# Altium schematic sheet ballbot_motor_discrete_v22.SchDoc: Ballbot直流电机驱动
size A4; Revision: 2.2; SheetNumber: 1; SheetTotal: 1
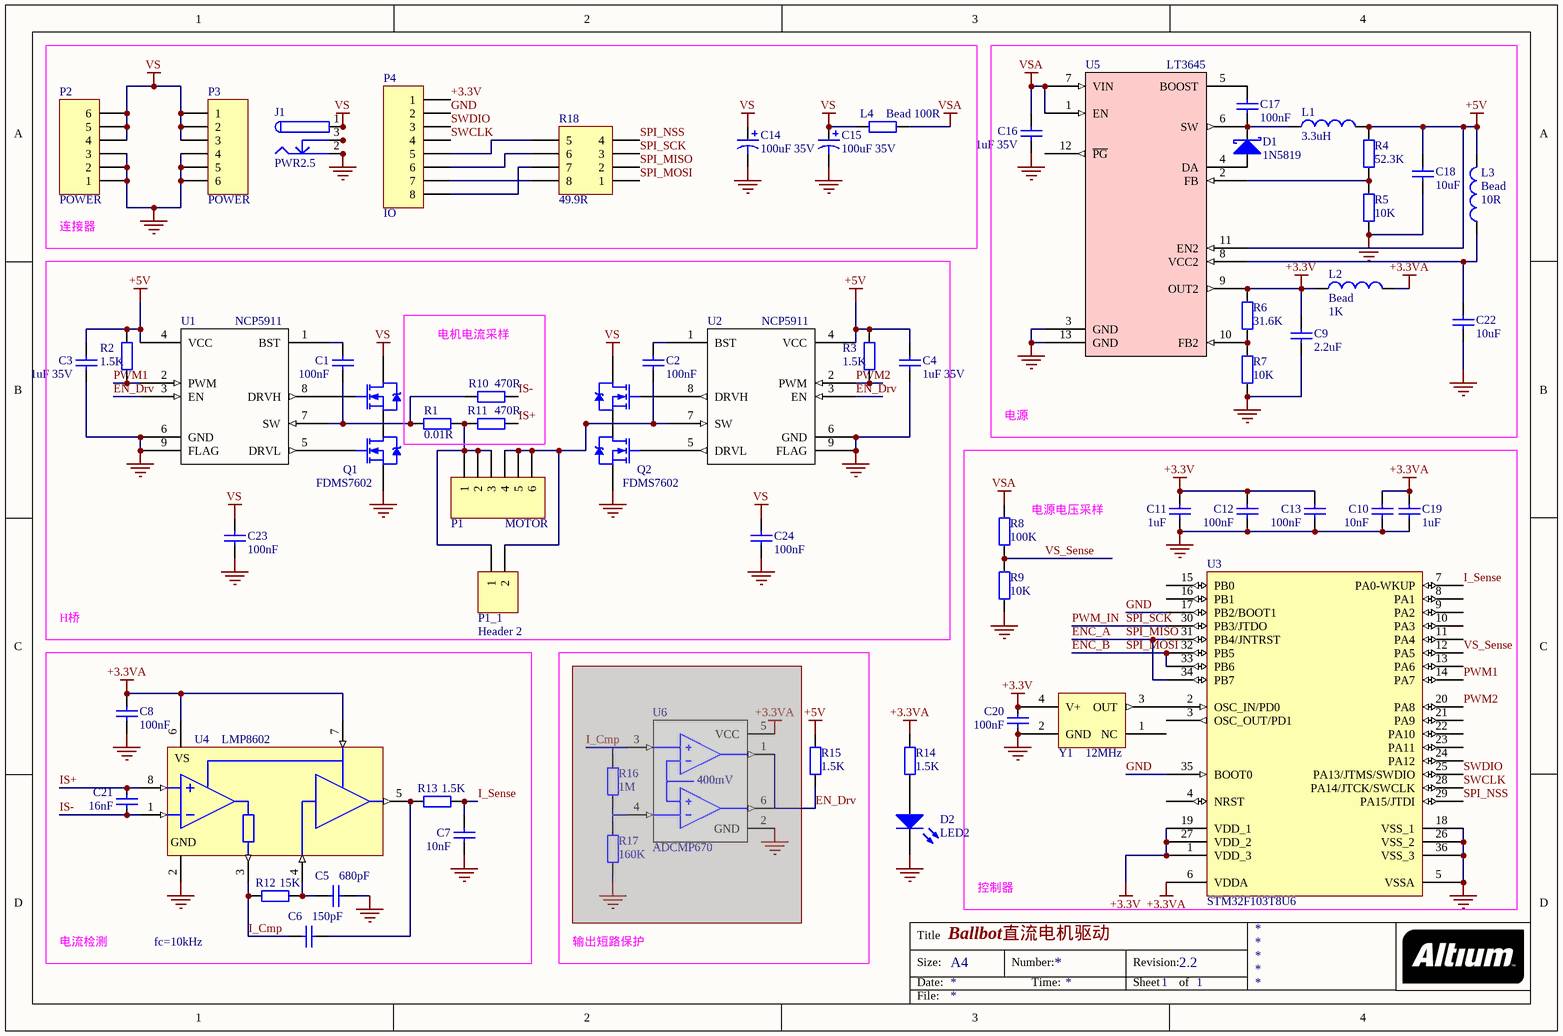
[diagram p0: ballbot_motor_discrete_v22.SchDoc]

## Parts
C1  value 100nF  [CAPC1608N]  (hidden comment: Cap Semi)
C2  value 100nF  [CAPC1608N]  (hidden comment: Cap Semi)
C3  value 1uF 35V  [CAPC1608N]  (hidden comment: Cap Semi)
C4  value 1uF 35V  [CAPC1608N]  (hidden comment: Cap Semi)
C5  value 680pF  [CAPC1608N]  (hidden comment: Cap Semi)
C6  value 150pF  [CAPC1608N]  (hidden comment: Cap Semi)
C7  value 10nF  [CAPC1608N]  (hidden comment: Cap Semi)
C8  value 100nF  [CAPC1608N]  (hidden comment: Cap Semi)
C9  value 2.2uF  [CAPC1608N]  (hidden comment: Cap Semi)
C10  value 10nF  [CAPC1608N]  (hidden comment: Cap Semi)
C11  value 1uF  [CAPC1608N]  (hidden comment: Cap Semi)
C12  value 100nF  [CAPC1608N]  (hidden comment: Cap Semi)
C13  value 100nF  [CAPC1608N]  (hidden comment: Cap Semi)
C14  value 100uF 35V  [TC7343-2917]  (hidden comment: Cap Pol3)
C15  value 100uF 35V  [TC7343-2917]  (hidden comment: Cap Pol3)
C16  value 1uF 35V  [CAPC1608N]  (hidden comment: Cap Semi)
C17  value 100nF  [CAPC1608N]  (hidden comment: Cap Semi)
C18  value 10uF  [CAPC1608N]  (hidden comment: Cap Semi)
C19  value 1uF  [CAPC1608N]  (hidden comment: Cap Semi)
C20  value 100nF  [CAPC1608N]  (hidden comment: Cap Semi)
C21  value 16nF  [CAPC1608N]  (hidden comment: Cap Semi)
C22  value 10uF  [CAPC1608N]  (hidden comment: Cap Semi)
C23  value 100nF  [CAPC1005N]  (hidden comment: Cap Semi)
C24  value 100nF  [CAPC1005N]  (hidden comment: Cap Semi)
D1  1N5819  [SOD323]
D2  LED2  [CD1608-0603]
J1  PWR2.5  [KLD-0202]
L1  value 3.3uH  [INDC2012N]  (hidden comment: Inductor)
L2  Bead  value 1K  [INDC1608AN]
L3  Bead  value 10R  [INDC1608AN]
L4  value Bead 100R  [RESC1608N]
P1  MOTOR  [2.54mm * 8-6 Edge]
P1_1  Header 2  [508x2]
P2  POWER  [2.54mm * 8-6 Edge]
P3  POWER  [2.54mm * 8-6 Edge]
P4  IO  [2.54mm * 8 Edge]
Q1  FDMS7602  [DFN56]
Q2  FDMS7602  [DFN56]
R1  value 0.01R  [RESC6432N]
R2  value 1.5K  [RESC1608N]
R3  value 1.5K  [RESC1608N]
R4  value 52.3K  [RESC1608N]
R5  value 10K  [RESC1608N]
R6  value 31.6K  [RESC1608N]
R7  value 10K  [RESC1608N]
R8  value 100K  [RESC1608N]
R9  value 10K  [RESC1608N]
R10  value 470R  [RESC1608N]
R11  value 470R  [RESC1608N]
R12  value 15K  [RESC1608N]
R13  value 1.5K  [RESC1608N]
R14  value 1.5K  [RESC1608N]
R15  value 1.5K  [RESC1608N]
R16  value 1M  [RESC1608N]  (masked out: inside a compile mask, not in the netlist)
R17  value 160K  [RESC1608N]  (masked out: inside a compile mask, not in the netlist)
R18  49.9R  [EXBV8V]
U1  NCP5911  [SON50P200X200X80-8N]
U2  NCP5911  [SON50P200X200X80-8N]
U3  STM32F103T8U6  [VFQN36_N_STM32]
U4  LMP8602  [TSOP65P490-8AN]
U5  LT3645  [QFN50P300X300-16W7N]
U6  ADCMP670  [SOT26A-6N]  (masked out: inside a compile mask, not in the netlist)
Y1  12MHz  [XTAL 2520]

## Blocks framed on the sheet
连接器: C14 C15 J1 L4 P2-P4 R18
电源: C9 C16-C18 C22 D1 L1-L3 R4-R7 U5
H桥: C1-C4 C23 C24 P1 P1_1 Q1 Q2 R2 R3 U1 U2
电机电流采样: R1 R10 R11
输出短路保护: R15-R17 U6

## Nets
+3.3V: C9.2 C11.2 C12.2 C13.2 C20.2 L2.1 P4.1 R6.1 U3.1(VDD_3) U3.19(VDD_1) U3.27(VDD_2) U5.9(OUT2) Y1.4(V+)
+3.3VA: C8.2 C10.2 C19.2 L2.2 R14.1 U3.6(VDDA) U4.6(VS) U4.7(OFFSET)
+5V: C3.2 C4.2 C18.2 L1.2 L3.2 R2.1 R3.1 R4.1 R15.1 U1.4(VCC) U2.4(VCC) U5.11(EN2)
GND: C3.1 C4.1 C5.1 C7.1 C8.1 C9.1 C10.1 C11.1 C12.1 C13.1 C14.2 C15.2 C16.1 C18.1 C19.1 C20.1 C22.1 C23.1 C24.1 D2.2(K) J1.2 J1.2A J1.2B P2.1 P2.2 P2.3 P3.4 P3.5 P3.6 P4.2 Q1.S2 Q2.S2 R5.2 R7.2 R9.2 U1.6(GND) U1.9(FLAG) U2.6(GND) U2.9(FLAG) U3.5(VSSA) U3.17(PB2/BOOT1) U3.18(VSS_1) U3.26(VSS_2) U3.35(BOOT0) U3.36(VSS_3) U4.2(GND) U5.3(GND) U5.13(GND) Y1.2(GND)
VS: C14.1 C15.1 C23.2 C24.2 J1.1 J1.1A J1.1B L4.1 P2.4 P2.5 P2.6 P3.1 P3.2 P3.3 Q1.D1 Q2.D1
VSA: C16.2 L4.2 R8.1 U5.1(EN) U5.7(VIN)
EN_Drv: R15.2 U1.3(EN) U2.3(EN)
ENC_A: R18.2 U3.31(PB4/JNTRST) U3.34(PB7)  [also labelled SPI_MISO]
ENC_B: R18.1 U3.32(PB5) U3.33(PB6)  [also labelled SPI_MOSI]
I_Cmp: C6.2 R12.2 U4.3(A1)
I_Sense: C7.2 R13.1 U3.7(PA0-WKUP)
IS+: C21.2 R11.2 U4.8(IN+)
IS-: C21.1 R10.2 U4.1(IN-)
PWM1: R2.2 U1.2(PWM) U3.14(PA7)
PWM2: R3.2 U2.2(PWM) U3.20(PA8)
PWM_IN: R18.3 U3.30(PB3/JTDO)  [also labelled SPI_SCK]
SPI_NSS: R18.4 U3.29(PA15/JTDI)
SWCLK: P4.4 U3.28(PA14/JTCK/SWCLK)
SWDIO: P4.3 U3.25(PA13/JTMS/SWDIO)
VS_Sense: R8.2 R9.1 U3.12(PA5)
NetC1_1: C1.1 Q1.S1D2 R1.1 R10.1 U1.7(SW)
NetC1_2: C1.2 U1.1(BST)
NetC2_1: C2.1 P1.4 P1.5 P1.6 P1_1.2 Q2.S1D2 U2.7(SW)
NetC2_2: C2.2 U2.1(BST)
NetC5_2: C5.2 R12.1 U4.4(A2)
NetC6_1: C6.1 R13.2 U4.5(OUT)
NetC17_1: C17.1 D1.2(K) L1.1 U5.6(SW)
NetC17_2: C17.2 U5.5(BOOST)
NetC22_2: C22.2 L3.1 U5.8(VCC2)
NetD1_1: D1.1(A) U5.4(DA)
NetD2_1: D2.1(A) R14.2
NetJ1_3: J1.3 J1.3A J1.3B
NetP1_1: P1.1 P1.2 P1.3 P1_1.1 R1.2 R11.1
NetP4_5: P4.5 R18.5
NetP4_6: P4.6 R18.6
NetP4_7: P4.7 R18.8
NetP4_8: P4.8 R18.7
NetQ1_G1: Q1.G1 U1.8(DRVH)
NetQ1_G2: Q1.G2 U1.5(DRVL)
NetQ2_G1: Q2.G1 U2.8(DRVH)
NetQ2_G2: Q2.G2 U2.5(DRVL)
NetR4_2: R4.2 R5.1 U5.2(FB)
NetR6_2: R6.2 R7.1 U5.10(FB2)
NetU3_2: U3.2(OSC_IN/PD0) Y1.3(OUT)

Not connected (* = marked no-connect by the designer): U3 3(OSC_OUT/PD1) 4(NRST) 8(PA1) 9(PA2) 10(PA3) 11(PA4) 13(PA6) 15(PB0) 16(PB1) 21(PA9) 22(PA10) 23(PA11) 24(PA12); U5 12(~{PG}); Y1 1(NC)

## Notes on the sheet
- (near R8) 电源电压采样
- 控制器
- 电流检测
- fc=10kHz
- Title
- Size:
- Date:
- A4
- Number:
- Time:
- Revision:
- Sheet
- of
- File:
- (in symbol ADCMP670) 400mV

## Library data of the parts
C1-C13 C16-C24 = Cap Semi: Capacitor (Semiconductor SIM Model); Published: 8-Jun-2000; LatestRevisionDate: 29-May-2009; LatestRevisionNote: IPC-7351 Footprint Added.; PackageReference: C1206; Publisher: Altium Limited; PackageDescription: Chip Capacitor
C14 C15 = Cap Pol3: Polarized Capacitor (Surface Mount); Published: 8-Jun-2000; LatestRevisionDate: 29-May-2009; LatestRevisionNote: IPC-7351 Footprint Added.; PackageReference: C0805; Publisher: Altium Limited; PackageDescription: Chip Capacitor
D1 = D Schottky: Schottky Diode; Published: 8-Jun-2000; LatestRevisionDate: 17-Jul-2002; LatestRevisionNote: Re-released for DXP Platform.; PackageReference: SMB; Publisher: Altium Limited; PackageDescription: DO-214-AA/SMB; 2 C-Bend Leads; Body 5.3 x 3.6 mm, inc. leads (LxW); Code_JEDEC: DO-214-AA
D2 = LED2: Typical RED, GREEN, YELLOW, AMBER GaAs LED; Published: 8-Jun-2000; LatestRevisionDate: 17-Jul-2002; LatestRevisionNote: Re-released for DXP Platform.; PackageVersion: Feb-2002; PackageReference: 3.2X1.6X1.1; Publisher: Altium Limited; PackageDescription: SM LED; 2 Flat Leads
J1 = PWR2.5: Low Voltage Power Supply Connector; Published: 17-Dec-2003; DatasheetDocument: 09-May-2002; Publisher: Altium Limited; ComponentLink1Description: Manufacturer Link; ComponentLink1URL: http://domino.kycon.com/internet/Products.html
L1-L3 = Inductor: Code_IEC: 1005; Published: 8-Jun-2000; LatestRevisionDate: 29-May-2009; LatestRevisionNote: IPC-7351 Footprint Added.; PackageReference: 0402-A; Publisher: Altium Limited; PackageDescription: Chip Inductor; Code_JEITA: 0402
L4 R1-R17 = Res2: Resistor; Published: 8-Jun-2000; LatestRevisionDate: 17-Jul-2002; LatestRevisionNote: Re-released for DXP Platform.; PackageReference: AXIAL-0.4; Publisher: Altium Limited; PackageDescription: Axial Device, Thru-Hole; 2 Leads; 0.4 in Pin Spacing
P1-P3 = Header 6: Header, 6-Pin; LatestRevisionDate: 17-Jul-2002; LatestRevisionNote: Re-released for DXP Platform.; Publisher: Altium Limited
P1_1 = Header 2: Header, 2-Pin; LatestRevisionDate: 17-Jul-2002; LatestRevisionNote: Re-released for DXP Platform.; Publisher: Altium Limited
P4 = Header 8: Header, 8-Pin; LatestRevisionDate: 17-Jul-2002; LatestRevisionNote: Re-released for DXP Platform.; Publisher: Altium Limited
Q1 Q2 = Dual NMOS
R18 = Header 4X2: Header, 4-Pin, Dual row; LatestRevisionDate: 17-Jul-2002; LatestRevisionNote: Re-released for DXP Platform.; Publisher: Altium Limited
U3 = STM32F103T8U6: STM32 ARM-based 32-bit MCU with 64 Kbytes Flash, 36-pin VFQFPN, Industrial Temperature; Published: 30-May-2008; DatasheetVersion: rev6, Mar-2008; PackageVersion: Mar-2008; PackageReference: VFQN36; Publisher: Altium Limited; PackageDescription: 36-Pin Quad Flat No-Lead, 6 x 6 X 1.0 mm Body, 0.5 mm Pitch, Exposed Pad (VFQN36); ComponentLink1Description: Manufacturer Link; ComponentLink1URL: www.st.com/stm32; ComponentLink2Description: Datasheet; ComponentLink2URL: http://www.st.com/stonline/products/literature/ds/13587.pdf
U4 = LMP8603
U5 = LT3645: pin to pad: 1>5 2>6 3>7 4>8 5>10 6>9 7>11 8>14 9>15 10>16 11>4 12>3 13>17
Y1 = Oscillator